# EAGLE design STM32 (EAGLE 8.6.3)
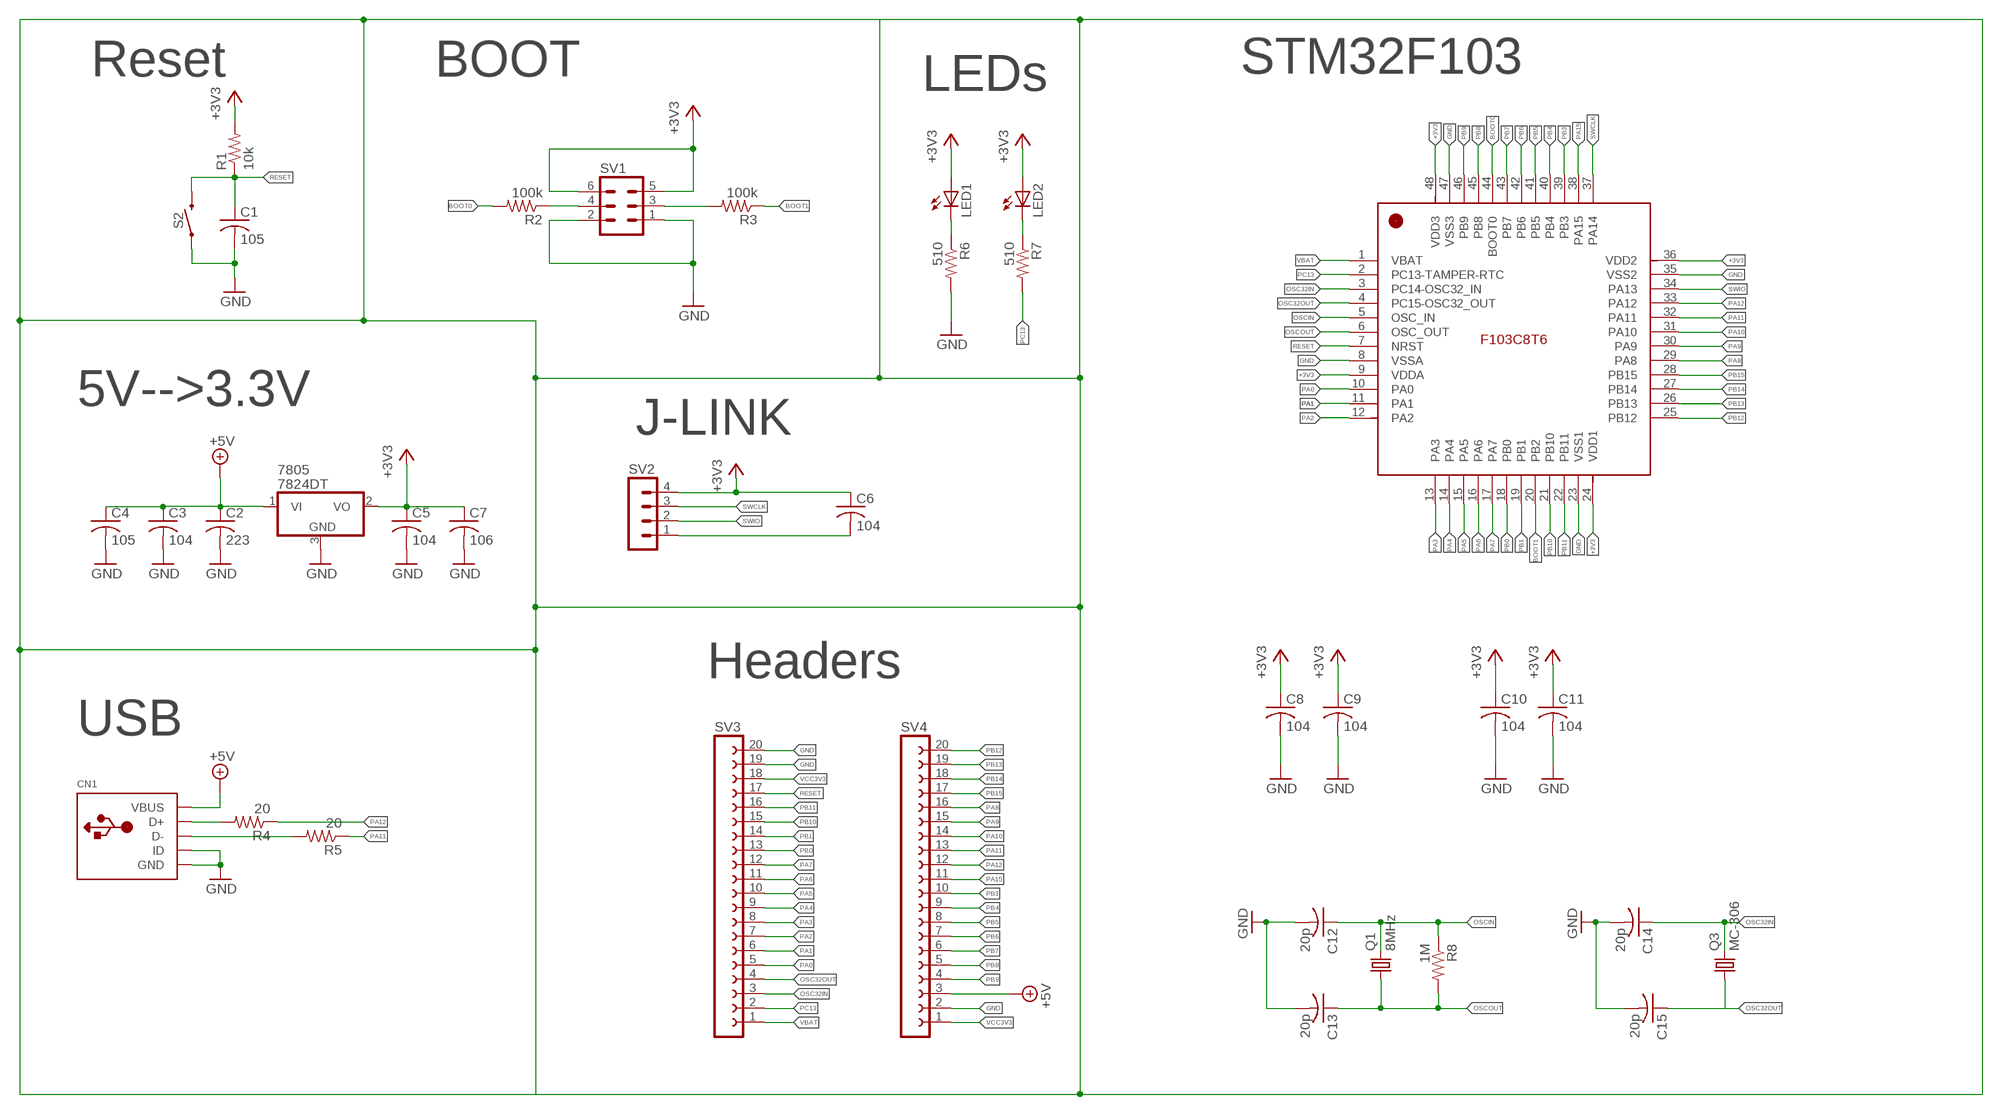
[diagram p0: schematic, sheet 1]

## Parts
7805  7824DT  [TO252]
C1  105  C-USC0603  [C0603]
C2  223  C-USC0603  [C0603]
C3  104  C-USC0603  [C0603]
C4  105  C-USC0805  [C0805]
C5  104  C-USC0603  [C0603]
C6  104  C-USC0603  [C0603]
C7  106  C-USC0805  [C0805]
C8  104  C-USC0603  [C0603]
C9  104  C-USC0603  [C0603]
C10  104  C-USC0603  [C0603]
C11  104  C-USC0603  [C0603]
C12  20p  C-USC0603  [C0603]
C13  20p  C-USC0603  [C0603]
C14  20p  C-USC0603  [C0603]
C15  20p  C-USC0603  [C0603]
CN1  USBMINIB  [USB-MINIB]
LED1  LEDCHIPLED_0805  [CHIPLED_0805]
LED2  LEDCHIPLED_0805  [CHIPLED_0805]
Q1  8MHz  CRYTALHC49U70  [HC49U70]
Q3  MC-306  [MC-306]
R1  10k  R-US_R0603  [R0603]
R2  100k  R-US_R0603  [R0603]
R3  100k  R-US_R0603  [R0603]
R4  20  R-US_R0603  [R0603]
R5  20  R-US_R0603  [R0603]
R6  510  R-US_R0603  [R0603]
R7  510  R-US_R0603  [R0603]
R8  1M  R-US_R0603  [R0603]
S2  MOMENTARY-SWITCH-SPST-SMD-5.2-REDUNDANT  [TACTILE_SWITCH_SMD_5.2MM]
SV1  MA03-2  [MA03-2]
SV2  MA04-1  [MA04-1]
SV3  FE20-1  [FE20]
SV4  FE20-1  [FE20]
U$1  STM32F103C8T6  [LQFP48_7X7MM_0.5MMPP]

## Nets
+3V3: 7805.2(VO) C5.1 C6.1 C7.1 C8.1 C9.1 C10.1 C11.1 LED1.A LED2.A R1.2 SV1.5 SV1.6 SV2.4 U$1.9(VDDA) U$1.24(VDD1) U$1.36(VDD2) U$1.48(VDD3)
+5V: 7805.1(VI) C2.1 C3.1 C4.1 CN1.VBUS SV4.3
BOOT0: R2.2 U$1.44(BOOT0)
BOOT1: R3.1 U$1.20(PB2)
GND: 7805.3(GND) C1.2 C2.2 C3.2 C4.2 C5.2 C7.2 C8.2 C9.2 C10.2 C11.2 C12.2 C13.2 C14.2 C15.2 CN1.GND CN1.ID R6.2 S2.1 S2.2 SV1.1 SV1.2 SV3.19 SV3.20 SV4.2 U$1.8(VSSA) U$1.23(VSS1) U$1.35(VSS2) U$1.47(VSS3)
N$1: R2.1 SV1.4
N$2: R3.2 SV1.3
N$3: LED1.C R6.1
N$5: CN1.D+ R4.2
N$6: CN1.D- R5.2
N$7: LED2.C R7.1
N$8: C6.2 SV2.1
OSC32IN: C14.1 Q3.4 SV3.3 U$1.3(PC14-OSC32_IN)
OSC32OUT: C15.1 Q3.1 SV3.4 U$1.4(PC15-OSC32_OUT)
OSCIN: C12.1 Q1.2 R8.1 U$1.5(OSC_IN)
OSCOUT: C13.1 Q1.1 R8.2 U$1.6(OSC_OUT)
PA0: SV3.5 U$1.10(PA0)
PA1: SV3.6 U$1.11(PA1)
PA2: SV3.7 U$1.12(PA2)
PA3: SV3.8 U$1.13(PA3)
PA4: SV3.9 U$1.14(PA4)
PA5: SV3.10 U$1.15(PA5)
PA6: SV3.11 U$1.16(PA6)
PA7: SV3.12 U$1.17(PA7)
PA8: SV4.16 U$1.29(PA8)
PA9: SV4.15 U$1.30(PA9)
PA10: SV4.14 U$1.31(PA10)
PA11: R5.1 SV4.13 U$1.32(PA11)
PA12: R4.1 SV4.12 U$1.33(PA12)
PA15: SV4.11 U$1.38(PA15)
PB0: SV3.13 U$1.18(PB0)
PB1: SV3.14 U$1.19(PB1)
PB3: SV4.10 U$1.39(PB3)
PB4: SV4.9 U$1.40(PB4)
PB5: SV4.8 U$1.41(PB5)
PB6: SV4.7 U$1.42(PB6)
PB7: SV4.6 U$1.43(PB7)
PB8: SV4.5 U$1.45(PB8)
PB9: SV4.4 U$1.46(PB9)
PB10: SV3.15 U$1.21(PB10)
PB11: SV3.16 U$1.22(PB11)
PB12: SV4.20 U$1.25(PB12)
PB13: SV4.19 U$1.26(PB13)
PB14: SV4.18 U$1.27(PB14)
PB15: SV4.17 U$1.28(PB15)
PC13: R7.2 SV3.2 U$1.2(PC13-TAMPER-RTC)
RESET: C1.1 R1.1 S2.3 S2.4 SV3.17 U$1.7(NRST)
SWCLK: SV2.3 U$1.37(PA14)
SWIO: SV2.2 U$1.34(PA13)
VBAT: SV3.1 U$1.1(VBAT)
VCC3V3: SV3.18 SV4.1

## Notes on the sheet
- Reset | BOOT | STM32F103
- LEDs
- 5V-->3.3V
- J-LINK
- Headers
- USB

## Library data of the parts
7805 = linear3:78*: Positive VOLTAGE REGULATOR Source: http://cache.national.com/ds/LM/LM78L05.pdf http://www.fairchildsemi.com/ds/LM/LM7805.pdf
C1-C15 = rcl:C-US: CAPACITOR, American symbol; SPICEPREFIX: C
CN1 = adafruit:USB: USB Connectors USBMINIB - Surface Mount Female Mini-B USB Connector 4UConnector: 06564 By microbuilder.eu Thru-hole RA Female Mini-B USB Connector 4UConnector: 18732 By ladyada.net
LED1 LED2 = adafruit:LED: LED OSRAM: - CHIPLED LG R971, LG N971, LY N971, LG Q971, LY Q971, LO R971, LY R971 LH N974, LH R974 LS Q976, LO Q976, LY Q976 LO Q996 - Hyper CHIPLED LW Q18S LB Q993, LB Q99A, LB R99A - SideLED LS A670, LO A670, LY A670, LG A670, LP A670 LB A673, LV A673, LT A673, LW A673 LH A674 LY A675 LS A676, LA A676, LO A676, LY A676, LW A676 LS A679, LY A679, LG A679 - Hyper Micro SIDELED® LS Y876, LA Y876, LO Y876, LY Y876 LT Y87S - SmartLED LW L88C, LW L88S LB L89C, LB L89S, LG L890 LS L89K, LO L89K, LY L89K LS L896, LA L896, LO L896, LY L896 - TOPLED LS T670, LO T670, LY T670, LG T670, LP T670 LSG T670, LSP T670, LSY T670, LOP T670, LYG T670 LG T671, LOG T671, LSG T671 LB T673, LV T673, LT T673, LW T673 LH T674 LS T676, LA T676, LO T676, LY T676, LB T676, LH T676, LSB T676, LW T676 LB T67C, LV T67C, LT T67C, LS T67K, LO T67K, LY T67K, LW E67C LS E67B, LA E67B, LO E67B, LY E67B, LB E67C, LV E67C, LT E67C LW T67C LS T679, LY T679, LG T679 LS T770, LO T770, LY T770, LG T770, LP T770 LB T773, LV T773, LT T773, LW T773 LH T774 LS E675, LA E675, LY E675, LS T675 LS T776, LA T776, LO T776, LY T776, LB T776 LHGB T686 LT T68C, LB T68C - Hyper Mini TOPLED® LB M676 - Mini TOPLED Santana® LG M470 LS M47K, LO M47K, LY M47K Source: http://www.osram.convergy.de/
Q1 = crystal:CRYTAL: CRYSTAL
Q3 = crystal:MC-306: kHz RANGE CRYSTAL UNIT SMD Source: MC-306_405_406_E07X.PDF Homepage <http://www.epsontoyocom.co.jp>; MPN: MC-306 60.0KHZ 100PPM ,12.5PF; OC_FARNELL: 1278040; OC_NEWARK: 31M5576
R1-R8 = rcl:R-US_: RESISTOR, American symbol; SPICEPREFIX: R
S2 = SparkFun-Switches:MOMENTARY-SWITCH-SPST: Momentary Switch (Pushbutton) - SPST Normally-open (NO) SPST momentary switches (buttons, pushbuttons). Variants PTH-12MM - 12mm square, through-hole Momentary Pushbutton Switch - 12mm Square <https://www.sparkfun.com/products/9190> (COM-09190) PTH-6.0MM, PTH-6.0MM-KIT - 6.0mm square, through-hole Mini Pushbutton Switch <https://www.sparkfun.com/products/97> (COM-00097) KIT package intended for soldering kit's - only one side of pads' copper is exposed. PTH-RIGHT-ANGLE-KIT - Right-angle, through-hole Right Angle Tactile Button <https://www.sparkfun.com/products/10791> - Used on SparkFun BigTime Watch Kit <https://www.sparkfun.com/products/11734> SMD-12MM - 12mm square, surface-mount Tactile Button - SMD (12mm) <https://www.sparkfun.com/products/12993> (COM-12993) Used on SparkFun PicoBoard <https://www.sparkfun.com/products/11888> SMD-4.5MM - 4.5mm Square Trackball Switch Used on SparkFun Blackberry Trackballer Breakout <https://www.sparkfun.com/products/13169> SMD-4.6MMX2.8MM - 4.60mm x 2.80mm, surface mount Used on SparkFun SAMD21 Mini Breakout <https://www.sparkfun.com/products/13664> SMD-5.2MM, SMD-5.2-REDUNDANT - 5.2mm square, surface-mount Mini Pushbutton Switch - SMD <https://www.sparkfun.com/products/8720> (COM-08720) Used on Arduino Pro Mini <https://www.sparkfun.com/products/11114> REDUNDANT package connects both switch circuits together SMD-6.0X3.5MM - 6.0 x 3.5mm, surface mount Momentary Reset Switch SMD <https://www.sparkfun.com/products/8229> (COM-08229) SMD-6.2MM-TALL - 6.2mm square, surface mount Tactile Button - SMD (6mm) <https://www.sparkfun.com/products/12992> Used on SparkFun Digital Sandbox <https://www.sparkfun.com/products/12651> SMD-RIGHT-ANGLE - Right-angle, surface mount Used on SparkFun Block for Intel® Edison - Arduino <https://www.sparkfun.com/products/13036>; PROD_ID: SWCH-08247; SF_SKU: COM-08720
SV1 = con-lstb:MA03-2: PIN HEADER; OC_FARNELL: unknown; OC_NEWARK: unknown
SV2 = con-lstb:MA04-1: PIN HEADER; OC_FARNELL: unknown; OC_NEWARK: unknown
SV3 SV4 = con-lsta:FE20-1: FEMALE HEADER; OC_FARNELL: unknown; OC_NEWARK: unknown
U$1 = STM32F103C8T6:STM32F103C8T6; AVAILABILITY: Unavailable; DESCRIPTION: Mainstream Performance line, ARM Cortex-M3 MCU with 64 Kbytes Flash, 72 MHz CPU, motor control, USB and CAN; MF: STMicroelectronics; MP: STM32F103C8T6; PACKAGE: LQFP-48 STMicroelectronics; PRICE: None

## Board
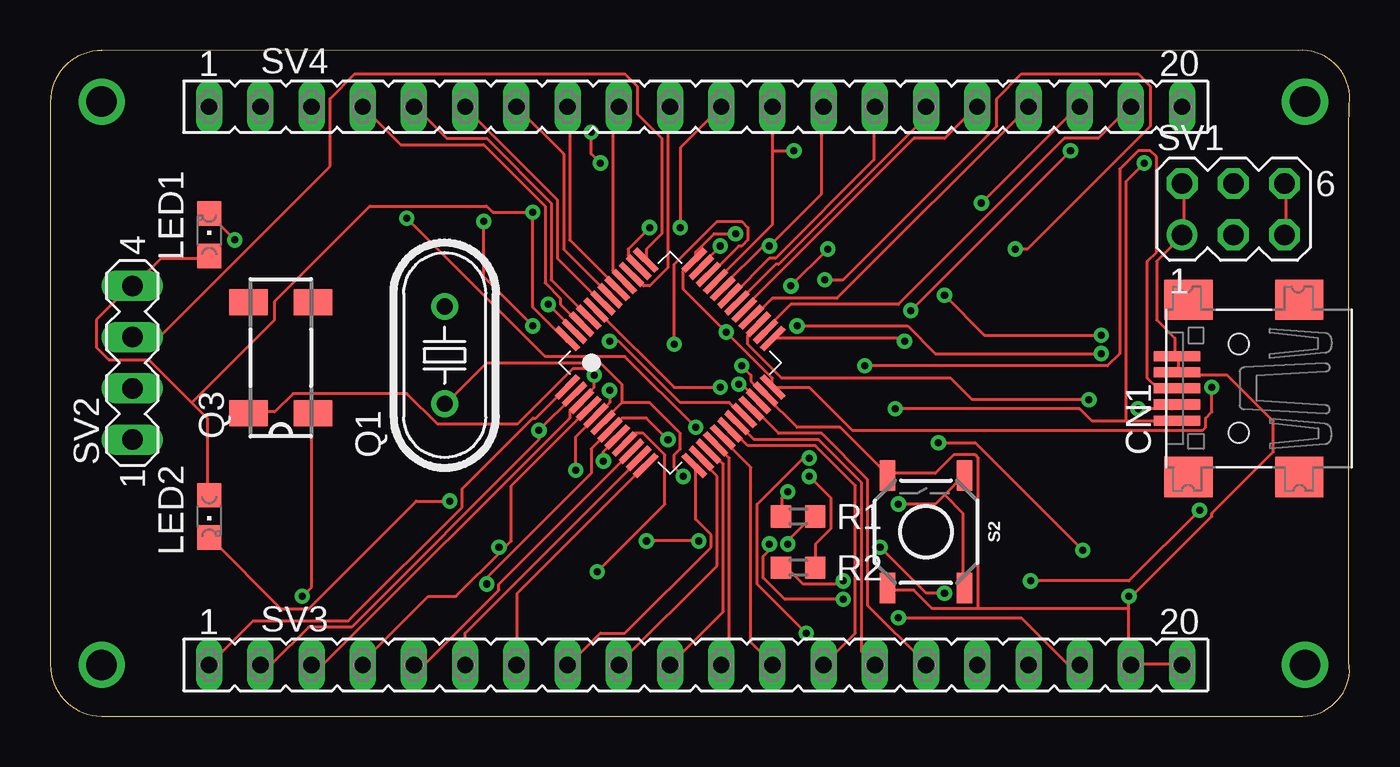
[diagram p1: board, top side]
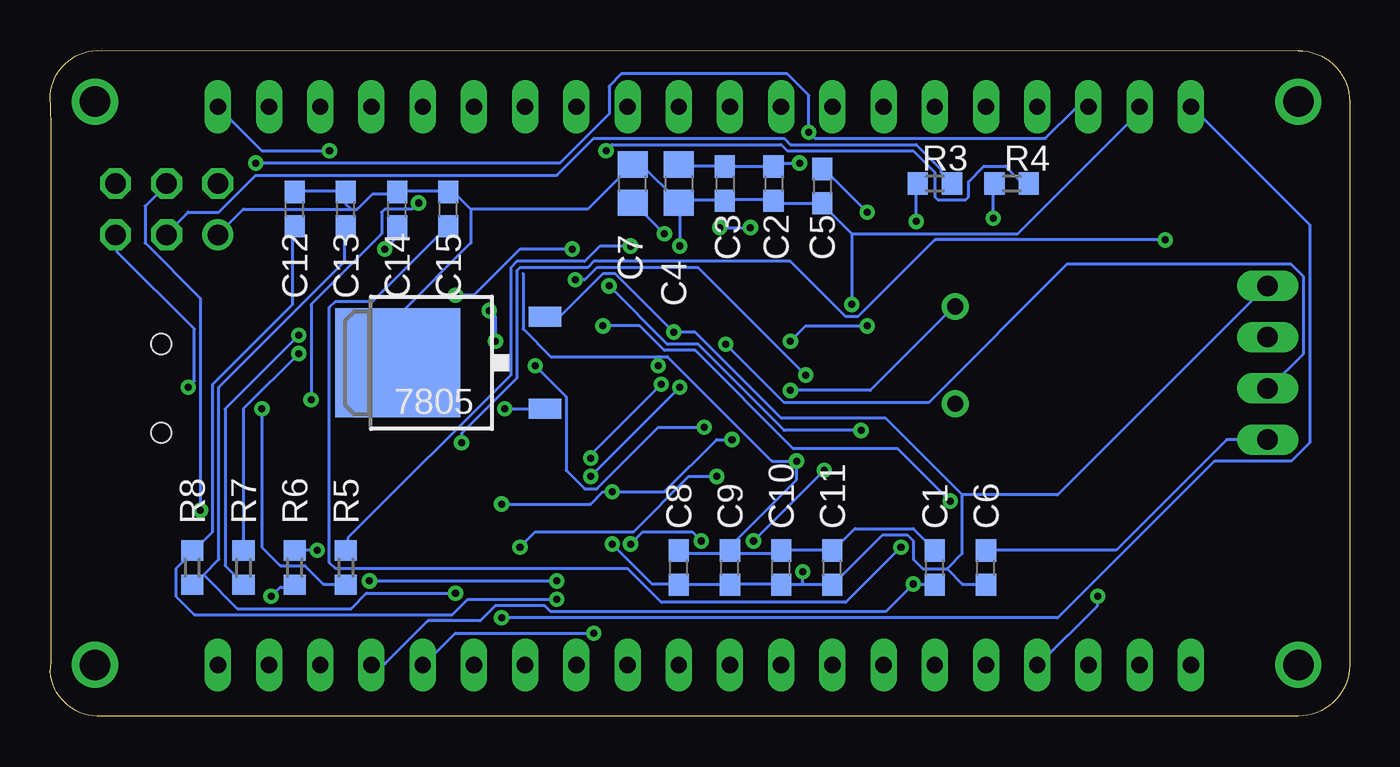
[diagram p2: board, bottom side, seen from below]

Size 64.44 x 33.03 mm. Coordinates in mm from the lower left corner, seen from the top.
Outline: 2.54,0.01 61.9,0.01 arc90 64.44,2.22 64.39,2.67 64.39,29.34 64.44,30.82 arc90 61.9,33.02 2.54,33.03 2.55,33.02 arc90 0,30.48 0,2.55 arc90 2.54,0.01
Copper layers (1*16): Top 0.035mm / dielectric 1.5mm / Bottom 0.035mm
Design rules "default": minimum track width 6mil, minimum drill 0.35mm, track to track 6mil, track to pad 6mil, pad to pad 6mil, via to via 6mil, smd to smd 6mil, copper to edge 40mil, drill to drill 6mil, minimum pad ring 10mil, minimum via ring 8mil, stop-mask expansion 4mil, vias tented up to drill 0mil, thermal gap 10mil

### Footprints (pad centres in the part's own frame; a part is rotated, then mirrored left to right if it is on the bottom)
TO252 = smd 1 x 1.6: 1 -2.28,-4.8; 2 2.28,-4.8 | smd 5.4 x 6.2: 3 0,2.5
C0603 = smd 1.1 x 1: 1 -0.85,0; 2 0.85,0
C0805 = smd 1.3 x 1.5: 1 -0.95,0; 2 0.95,0
USB-MINIB = smd 0.5 x 2.308: D+ 0,4.064; D- -0.8,4.064; GND 1.6,4.064; ID 0.8,4.064; VBUS -1.6,4.064 | smd 2 x 2.4: GND1 -4.4,-2; GND2 -4.4,3.5; GND3 4.4,3.5; GND4 4.4,-2 | hole 1: -2.2,1; 2.2,1
CHIPLED_0805 = smd 1.2 x 1.2: A 0,-1.05; C 0,1.05
HC49U70 = drill 0.813: 1 -2.413,0; 2 2.413,0
MC-306 = smd 1.3 x 1.9: 1 -2.75,-1.6; 2 2.75,-1.6; 3 2.75,1.6; 4 -2.75,1.6
R0603 = smd 1 x 1.1: 1 -0.85,0; 2 0.85,0
TACTILE_SWITCH_SMD_5.2MM = smd 1.524 x 0.762: 1 -2.794,1.905; 2 2.794,1.905; 3 -2.794,-1.905; 4 2.794,-1.905
MA03-2 = drill 1.016: 1 -2.54,-1.27 | drill 1.016 octagon: 2 -2.54,1.27; 3 0,-1.27; 4 0,1.27; 5 2.54,-1.27; 6 2.54,1.27
MA04-1 = drill 1.016 long: 1 -3.81,0; 2 -1.27,0; 3 1.27,0; 4 3.81,0
FE20 = drill 0.813 long: 1 -24.13,0; 2 -21.59,0; 3 -19.05,0; 4 -16.51,0; 5 -13.97,0; 6 -11.43,0; 7 -8.89,0; 8 -6.35,0; 9 -3.81,0; 10 -1.27,0; 11 1.27,0; 12 3.81,0; 13 6.35,0; 14 8.89,0; 15 11.43,0; 16 13.97,0; 17 16.51,0; 18 19.05,0; 19 21.59,0; 20 24.13,0
LQFP48_7X7MM_0.5MMPP = smd 1.5 x 0.3: 1 -4.45,2.75; 2 -4.45,2.25; 3 -4.45,1.75; 4 -4.45,1.25; 5 -4.45,0.75; 6 -4.45,0.25; 7 -4.45,-0.25; 8 -4.45,-0.75; 9 -4.45,-1.25; 10 -4.45,-1.75; 11 -4.45,-2.25; 12 -4.45,-2.75; 25 4.45,-2.75; 26 4.45,-2.25; 27 4.45,-1.75; 28 4.45,-1.25; 29 4.45,-0.75; 30 4.45,-0.25; 31 4.45,0.25; 32 4.45,0.75; 33 4.45,1.25; 34 4.45,1.75; 35 4.45,2.25; 36 4.45,2.75 | smd 0.3 x 1.5: 13 -2.75,-4.45; 14 -2.25,-4.45; 15 -1.75,-4.45; 16 -1.25,-4.45; 17 -0.75,-4.45; 18 -0.25,-4.45; 19 0.25,-4.45; 20 0.75,-4.45; 21 1.25,-4.45; 22 1.75,-4.45; 23 2.25,-4.45; 24 2.75,-4.45; 37 2.75,4.45; 38 2.25,4.45; 39 1.75,4.45; 40 1.25,4.45; 41 0.75,4.45; 42 0.25,4.45; 43 -0.25,4.45; 44 -0.75,4.45; 45 -1.25,4.45; 46 -1.75,4.45; 47 -2.25,4.45; 48 -2.75,4.45

### Placement (x,y rotation side)
7805  44.7,17.53 90 bottom
C1  20.57,7.37 90 bottom
C2  28.57,26.42 270 bottom
C3  30.99,26.42 270 bottom
C4  33.27,26.42 270 bottom
C5  26.16,26.29 270 bottom
C6  18.03,7.37 90 bottom
C7  35.56,26.42 90 bottom
C8  33.27,7.37 90 bottom
C9  30.73,7.37 90 bottom
C10  28.19,7.37 90 bottom
C11  25.65,7.37 90 bottom
C12  52.32,25.15 90 bottom
C13  49.78,25.15 90 bottom
C14  47.24,25.15 90 bottom
C15  44.7,25.15 90 bottom
CN1  59.94,16.26 90 top
LED1  7.87,23.88 0 top
LED2  7.87,9.91 180 top
Q1  19.56,17.91 90 top
Q3  11.43,17.79 90 top
R1  37.08,9.91 0 top
R2  37.08,7.37 0 top
R3  20.57,26.42 0 bottom
R4  16.76,26.42 180 bottom
R5  49.78,7.37 270 bottom
R6  52.32,7.37 270 bottom
R7  54.86,7.37 270 bottom
R8  57.4,7.37 270 bottom
S2  43.43,9.15 90 top
SV1  58.67,25.15 0 top
SV2  4.06,17.53 90 top
SV3  32,2.55 0 top
SV4  32,30.23 0 top
U$1  30.73,17.53 45 top

### Tracks (layer width: path | path; a pad name or v marks a point on that pad's centre or on a via)
+3V3  (via drill 0.35)
  Top 0.152: SV1.5 61.27,23.93 61.27,26.37 SV1.6 | v57.61,16.31 57.61,15.09 57.3,14.79 57.3,14.33 57.15,14.18 39.78,14.18 37.64,16.31 35.97,16.31 U$1.24 35.81,16.46 35.81,16.77 v33.53,19.06 31.39,21.19 31.39,22.1 31.85,22.56 U$1.36 32,22.71 32,23.02 32.92,23.93 v33.98,23.93 | v36.58,8.54 36.58,8.69 37.8,9.91 R1.2 | v27.13,7.17 30.48,10.52 30.48,12.96 29.41,14.03 28.96,14.03 28.5,13.57 U$1.9 | U$1.48 25.6,18.6 23.93,20.27 v23.93,25 21.95,25 21.64,25.3 15.85,25.3 11.12,20.58 11.12,19.67 7.01,15.55 | 7.01,15.55 4.88,17.68 2.9,17.68 2.29,18.29 2.29,19.67 3.96,21.34 SV2.4 4.12,21.34 5.49,22.71 7.77,22.71 LED1.A | 7.01,15.55 7.77,14.79 7.77,10.98 LED2.A
  Bottom 0.152: v57.61,16.31 57.3,16.62 57.3,19.21 61.11,23.02 61.11,23.78 SV1.5 | v36.58,8.54 34.59,6.56 33.38,6.56 C8.1 33.22,6.56 30.79,6.56 C9.1 30.63,6.56 28.19,6.56 | 28.19,6.56 27.13,6.56 | 27.13,6.56 25.76,6.56 C11.1 25.6,6.56 23.16,9 21.95,9 21.64,8.69 21.64,7.78 21.18,7.32 19.96,7.32 | 27.13,6.56 v27.13,7.17 | 28.19,6.56 C10.1 | v33.98,23.93 35.51,25.46 C7.1 | 7805.2 39.78,19.82 39.17,19.82 37.03,21.95 36.42,21.95 v33.53,19.06 32.46,19.06 28.19,14.79 23.01,14.79 19.2,10.98 | 19.96,7.32 19.2,6.56 18.14,6.56 C6.1 | 19.2,10.98 19.2,8.08 19.96,7.32 | v23.93,25 26.06,27.13 C5.1 | 19.2,10.98 14.48,10.98 4.12,21.34 SV2.4
+5V  (via drill 0.35)
  Top 0.152: v41.91,15.25 51.05,15.25 51.66,14.64 53.34,14.64 | 53.34,14.64 55.78,14.64 CN1.VBUS | v26.82,28.96 26.82,27.89 v27.28,27.44 | 53.34,14.64 53.34,26.52 v54.25,27.44
  Bottom 0.152: C4.1 33.22,27.29 31.09,27.29 C3.1 30.94,27.29 28.65,27.29 C2.1 28.5,27.29 28.35,27.44 v27.28,27.44 | v41.91,15.25 39.93,15.25 7805.1 | SV4.3 12.95,30.18 13.56,30.18 15.09,28.66 26.52,28.66 v26.82,28.96 26.82,30.79 27.89,31.86 36.12,31.86 36.73,31.25 36.73,29.88 39.17,27.44 v54.25,27.44
BOOT0  (via drill 0.35)
  Top 0.152: v37.64,11.89 38.71,10.83 38.71,9.3 37.95,8.54 37.95,7.47 R2.2 | v33.22,16.31 30.94,16.31 27.13,20.12 U$1.44
  Bottom 0.152: v33.22,16.31 v37.64,11.89
BOOT1  (via drill 0.35)
  Top 0.152: v21.49,24.54 21.49,21.8 v23.93,19.36 | v27.74,18.6 28.19,18.6 31.24,15.55 33.68,15.55 34.29,14.94 U$1.20
  Bottom 0.152: v21.49,24.54 21.49,26.37 R3.1 | v23.93,19.36 26.98,19.36 v27.74,18.6
GND  (via drill 0.35)
  Top 0.152: SV1.2 56.24,26.37 56.24,23.93 SV1.1 56.08,23.78 54.86,22.56 54.86,19.67 55.78,18.75 55.78,17.99 CN1.GND 55.93,17.84 55.93,17.07 CN1.ID 55.93,16.92 58.37,16.92 60.66,14.64 60.66,13.11 57.61,10.06 57.61,9.91 53.49,5.8 | 53.49,5.34 53.49,2.6 SV3.19 53.65,2.6 56.08,2.6 SV3.20 | 53.49,5.34 53.49,5.8 | 53.49,5.34 46.02,5.34 | 46.02,5.34 43.74,5.34 42.82,6.25 41.6,6.25 S2.1 | 46.02,5.34 46.02,12.81 45.87,12.96 44.81,12.96 43.89,12.05 41.6,12.05 S2.2 41.45,12.05 39.17,14.33 37.03,14.33 35.51,15.86 U$1.23 35.36,16.01 34.75,16.62 34.75,16.92 v34.29,17.38 | 53.49,5.8 v53.49,5.95 | v27.43,12.65 27.43,13.11 28.04,13.72 U$1.8 | v33.22,23.32 32.31,22.41 U$1.35 | v24.69,20.43 25.91,19.21 U$1.47
  Bottom 0.152: 49.53,25.15 54.86,25.15 SV1.1 | 49.53,25.15 49.23,25.15 48.46,25.91 47.24,25.91 C14.2 47.24,26.07 44.81,26.07 C15.2 44.65,25.91 44.35,25.91 43.59,25.15 | 43.59,25.15 43.59,23.48 47.09,19.97 47.09,17.53 7805.3 | v53.49,5.95 53.03,6.41 52.43,6.41 R6.2 | C9.2 30.79,8.08 33.22,8.08 C8.2 | C9.2 30.63,8.24 30.63,8.54 27.43,11.74 v27.43,12.65 28.65,12.65 33.83,17.84 34.29,17.84 | C9.2 30.63,8.08 28.19,8.08 C10.2 25.76,8.24 C11.2 25.6,8.24 24.54,9.3 21.64,9.3 C1.2 | C4.2 33.22,25.61 31.09,25.61 C3.2 30.94,25.61 28.65,25.61 C2.2 28.5,25.46 26.21,25.46 C5.2 26.06,25.3 24.69,23.93 | v33.22,23.32 33.22,25.46 C4.2 | C4.2 33.38,25.61 35.05,27.29 35.51,27.29 C7.2 35.66,27.29 37.8,25.15 43.59,25.15 | 24.69,23.93 v24.69,20.43 | 24.69,23.93 16.46,23.93 10.52,29.88 10.52,30.18 SV4.2 | 34.29,17.84 39.62,17.84 41,19.21 41,21.95 | 34.29,17.84 v34.29,17.38 | 49.53,25.15 49.78,25.41 C13.2 49.84,26.07 52.27,26.07 C12.2
N$1  (via drill 0.35)
  Top 0.152: v39.32,6.71 39.17,6.56 37.34,6.56 36.58,7.32 36.27,7.32 R2.1 | v48.62,6.71 53.49,6.71 v57,10.22
  Bottom 0.152: v48.62,6.71 v39.32,6.71 | v57,10.22 57,20.73 59.74,23.48 59.74,25.3 58.67,26.37 SV1.4
N$2
  Bottom 0.152: R3.2 19.81,26.52 20.27,26.98 20.27,27.13 21.49,28.35 27.74,28.35 28.04,28.66 37.49,28.66 39.32,26.83 54.25,26.83 56.08,25 57.61,25 58.67,23.93 SV1.3
N$3  (via drill 0.35)
  Top 0.152: v51.21,8.24 45.87,13.57 v44.04,13.57 | v9.14,23.63 7.92,24.85 LED1.C
  Bottom 0.152: v51.21,8.24 52.27,8.24 R6.1 | v44.04,13.57 44.04,14.03 41.3,16.77 41.3,22.1 41.15,22.26 37.8,22.26 37.49,22.56 27.74,22.56 24.99,19.82 24.38,19.82 20.57,23.63 v9.14,23.63
N$5  (via drill 0.35)
  Top 0.152: v17.68,24.69 24.54,17.84 28.5,17.84 v32,14.33 | v40.39,17.38 52.43,17.38 53.03,17.99 53.03,27.13 53.95,28.05 54.56,28.05 54.86,27.74 54.86,23.02 54.41,22.56 54.41,16.77 54.86,16.31 55.78,16.31 CN1.D+
  Bottom 0.152: v17.68,24.69 17.68,26.37 R4.2 | v32,14.33 34.29,14.33 37.34,11.28 37.95,11.28 38.86,12.2 38.86,15.86 v40.39,17.38
N$6  (via drill 0.35)
  Top 0.152: v53.95,15.25 55.63,15.25 55.78,15.4 CN1.D-
  Bottom 0.152: v53.95,15.25 53.95,8.39 53.03,7.47 51.82,7.47 50.9,6.56 49.84,6.56 R5.2
N$7  (via drill 0.35)
  Top 0.152: v52.12,17.99 43.89,17.99 42.52,19.36 v37.03,19.36 | v19.81,10.67 18.14,10.67 12.8,5.34 11.43,5.34 7.92,8.84 LED2.C
  Bottom 0.152: R7.1 54.86,15.25 v52.12,17.99 | v37.03,19.36 35.2,19.36 33.98,18.14 32.46,18.14 27.58,13.26 22.4,13.26 v19.81,10.67
N$8
  Bottom 0.152: SV2.1 6.1,13.72 11.58,8.24 17.98,8.24 C6.2
N$10  (via drill 1.52)
  other vias: 2.54,2.55
N$11  (via drill 1.52)
  other vias: 62.23,2.55
N$12  (via drill 1.52)
  other vias: 62.23,30.49
N$13  (via drill 1.52)
  other vias: 2.54,30.49
OSC32IN  (via drill 0.35)
  Top 0.152: v47.85,23.17 48.46,23.17 54.56,29.27 54.56,31.25 53.95,31.86 48.16,31.86 46.94,30.64 46.94,29.27 39.32,21.65 v38.41,21.65 | Q3.4 9.91,15.09 11.12,15.09 12.04,16.01 17.68,16.01 19.2,14.48 23.16,14.48 25.91,17.23 26.67,17.23 v26.98,16.92 26.98,16.31 26.36,15.7 U$1.3 26.21,15.55 25.76,15.09 25.76,14.79 13.56,2.6 12.95,2.6 SV3.3
  Bottom 0.152: C14.1 47.24,23.78 v47.85,23.17 | v38.41,21.65 37.95,21.65 37.34,22.26 32.31,22.26 v26.98,16.92
OSC32OUT  (via drill 0.35)
  Top 0.152: 22.4,8.24 20.12,5.95 18.75,5.95 15.39,2.6 SV3.4 | 22.4,8.24 22.86,8.69 22.86,11.44 26.67,15.25 U$1.4 | 22.4,8.24 v22.25,8.39 | v12.5,5.95 12.95,6.41 12.95,14.94 Q3.1
  Bottom 0.152: v22.25,8.39 24.99,5.64 34.14,5.64 35.81,7.32 50.29,7.32 50.6,7.63 50.6,20.27 50.29,20.58 48.46,20.58 44.81,24.24 C15.1 | v12.5,5.95 12.5,5.49 15.39,2.6 SV3.4
OSCIN  (via drill 0.35)
  Top 0.152: v27.74,16.16 27.74,15.55 27.13,14.94 U$1.5 26.98,14.79 26.06,13.87 v26.06,12.2 | v32.16,8.69 v29.57,8.69 | v35.66,8.54 35.66,8.24 35.36,7.93 35.36,6.86 36.42,5.8 v39.32,5.8
  Bottom 0.152: v27.74,16.16 23.77,16.16 19.66,20.27 Q1.2 | C12.1 52.43,24.24 52.43,20.43 56.39,16.46 56.39,9.15 57.3,8.24 R8.1 57.45,8.08 58.22,7.32 58.22,5.95 57.3,5.03 44.5,5.03 43.74,5.8 v39.32,5.8 | v29.57,8.69 v26.06,12.2 | v32.16,8.69 32.61,9.15 35.05,9.15 v35.66,8.54
OSCOUT  (via drill 0.35)
  Top 0.152: 28.35,15.55 27.43,14.64 U$1.6 | 28.35,15.55 28.35,16.46 27.28,17.53 21.64,17.53 19.66,15.55 Q1.1 | 28.35,15.55 29.72,15.55 31.24,14.03 31.24,13.26 30.94,12.96 30.94,12.35 v31.39,11.89 | v41.15,8.39 43.43,6.1 v44.35,6.1
  Bottom 0.152: 56.84,7.02 57.3,6.56 R8.2 | 56.84,7.02 56.08,7.78 56.08,16.31 49.84,22.56 49.84,24.24 C13.1 | v31.39,11.89 32.77,11.89 35.51,9.15 40.39,9.15 v41.15,8.39 | v44.35,6.1 48.77,6.1 49.53,5.34 55.17,5.34 56.84,7.02
PA0
  Top 0.152: U$1.10 28.8,13.11 22.25,6.56 22.25,6.25 18.59,2.6 18.14,2.6 SV3.5
PA1
  Top 0.152: SV3.6 20.57,4.12 29.11,12.65 U$1.11
PA2
  Top 0.152: U$1.12 29.41,12.35 23.16,6.1 23.16,2.6 SV3.7
PA3
  Top 0.152: U$1.13 32,12.35 32,9.76 32.77,9 32.77,8.39 28.5,4.12 27.28,4.12 25.76,2.6 SV3.8
PA4
  Top 0.152: U$1.14 32.31,12.65 33.07,11.89 33.07,7.47 28.19,2.6 SV3.9
PA5
  Top 0.152: SV3.10 33.38,5.19 33.38,12.5 32.77,13.11 U$1.15
PA6
  Top 0.152: U$1.16 33.07,13.42 33.68,12.81 33.68,2.9 33.38,2.6 SV3.11
PA7
  Top 0.152: U$1.17 33.38,13.72 34.75,12.35 34.75,3.66 35.81,2.6 SV3.12
PA8
  Top 0.152: U$1.29 34.44,20.27 42.82,28.66 44.35,28.66 45.87,30.18 SV4.16
PA9
  Top 0.152: SV4.15 43.43,29.72 36.12,22.41 35.97,22.41 34.14,20.58 U$1.30
PA10
  Top 0.152: U$1.31 33.83,20.88 35.66,22.71 35.97,22.71 40.84,27.59 40.84,30.18 SV4.14
PA11  (via drill 0.35)
  Top 0.152: U$1.32 33.38,21.34 35.36,23.32 v35.66,23.32 38.25,25.91 38.25,30.18 SV4.13
  Bottom 0.152: v35.66,23.32 37.19,23.32 37.95,22.56 41.3,22.56 41.6,22.26 41.6,16.92 49.68,8.84 49.68,8.24 R5.1
PA12  (via drill 0.35)
  Top 0.152: SV4.12 35.81,28.05 | 35.81,28.05 35.81,24.39 33.07,21.65 U$1.33 | 35.81,28.05 v36.88,28.05
  Bottom 0.152: v36.88,28.05 36.58,28.35 28.19,28.35 27.89,28.05 21.64,28.05 20.57,26.98 20.57,25.76 20.42,25.61 19.05,25.61 18.9,25.76 18.9,26.52 18.14,27.29 17.07,27.29 16.31,26.52 16,26.52 R4.1
PA15  (via drill 0.35)
  Top 0.152: v29.72,24.24 28.65,23.17 28.65,22.87 29.11,22.41 U$1.38 | v31.24,24.24 31.24,28.2 SV4.11
  Bottom 0.152: v31.24,24.24 v29.72,24.24
PB0
  Top 0.152: SV3.13 39.93,4.12 39.93,11.44 37.95,13.42 34.59,13.42 33.83,14.18 U$1.18
PB1
  Top 0.152: SV3.14 40.23,3.21 40.23,11.59 38.1,13.72 34.9,13.72 34.14,14.48 U$1.19
PB3
  Top 0.152: U$1.39 28.96,21.8 29.41,21.34 29.72,21.34 30.63,22.26 30.63,30.18 SV4.10
PB4
  Top 0.152: U$1.40 28.35,21.65 27.89,22.1 27.89,29.88 28.19,30.18 SV4.9
PB5
  Top 0.152: U$1.41 28.04,21.34 25.76,23.63 25.76,30.18 SV4.8
PB6
  Top 0.152: SV4.7 25.45,27.89 25.45,23.17 27.74,20.88 U$1.42
PB7
  Top 0.152: U$1.43 27.28,20.58 25.15,22.71 25.15,25.61 20.57,30.18 SV4.6
PB8
  Top 0.152: U$1.45 26.67,19.82 24.84,21.65 24.84,25.46 21.64,28.66 19.66,28.66 18.14,30.18 SV4.5
PB9
  Top 0.152: SV4.4 17.37,28.35 21.49,28.35 24.54,25.3 24.54,21.49 25.3,20.73 25.3,20.43 26.21,19.51 U$1.46
PB10
  Top 0.152: U$1.21 34.9,15.25 36.12,14.03 38.25,14.03 40.54,11.74 40.54,5.49 43.43,2.6 SV3.15
PB11  (via drill 0.35)
  Top 0.152: v34.14,16.46 34.29,16.46 35.05,15.7 U$1.22 | v37.64,12.81 37.34,12.81 35.05,10.52 35.05,6.56 v37.49,4.12
  Bottom 0.152: v34.14,16.46 37.64,12.96 v37.64,12.81 | v37.49,4.12 44.35,4.12 45.87,2.6 SV3.16
PB12  (via drill 0.35)
  Top 0.152: v42.37,18.6 42.22,18.75 35.97,18.75 U$1.25 | v50.6,28.05 v42.67,20.12
  Bottom 0.152: v42.37,18.6 42.37,19.82 v42.67,20.12 | v50.6,28.05 53.95,28.05 SV4.20
PB13
  Top 0.152: U$1.26 35.51,19.21 36.73,20.43 42.06,20.43 50.29,28.66 51.97,28.66 53.49,30.18 SV4.19
PB14  (via drill 0.35)
  Top 0.152: v51.51,15.7 45.72,15.7 44.65,16.77 36.27,16.77 34.59,18.45 34.59,18.9 35.05,19.36 U$1.27 | v46.18,25.46 51.05,30.33 SV4.18
  Bottom 0.152: v51.51,15.7 51.51,20.43 48.01,23.93 48.01,25 47.85,25.15 46.48,25.15 v46.18,25.46
PB15
  Top 0.152: SV4.17 39.01,20.73 35.81,20.73 34.9,19.82 U$1.28
PC13  (via drill 0.35)
  Top 0.152: v52.12,18.9 46.33,18.9 v44.35,20.88 | v36.73,21.34 v38.56,23.17 | U$1.2 25.91,15.86 v24.23,14.18 24.23,13.72 14.94,4.43 12.8,4.43 10.97,2.6 10.52,2.6 SV3.2
  Bottom 0.152: v52.12,18.9 55.78,15.25 55.78,7.47 54.86,6.56 R7.2 | v44.35,20.88 43.43,20.88 41.15,23.17 v38.56,23.17 | v36.73,21.34 33.83,18.45 32.31,18.45 28.04,14.18 v24.23,14.18
RESET  (via drill 0.35)
  Top 0.152: v21.64,6.56 21.64,6.86 26.82,12.05 26.82,13.26 27.74,14.18 U$1.7 27.89,14.33 28.35,14.79 29.57,14.79 v30.63,13.72 | v36.58,11.13 36.27,10.83 36.27,9.91 R1.1 | v42.06,10.52 43.89,10.52 44.35,10.98 | 44.35,10.98 45.26,11.89 S2.4 | 44.35,10.98 45.26,10.06 45.26,6.41 S2.3
  Bottom 0.152: C1.1 20.57,6.56 v21.64,6.56 23.01,5.19 39.62,5.19 39.93,5.49 42.37,5.49 43.13,4.73 45.72,4.73 47.85,2.6 48.46,2.6 SV3.17 | v42.06,10.52 37.64,10.52 37.03,11.13 v36.58,11.13 33.98,11.13 31.39,13.72 v30.63,13.72
SWCLK
  Top 0.152: U$1.37 29.57,22.71 29.57,23.17 30.33,23.93 30.33,28.66 29.11,29.88 29.11,31.25 28.5,31.86 15.09,31.86 13.87,30.64 13.87,27.29 5.49,18.9 4.12,18.9 SV2.3
SWIO  (via drill 0.35)
  Top 0.152: v30.94,18.45 30.94,22.41 33.07,24.54 34.29,24.54 34.59,24.24 34.59,23.63 34.29,23.32 34.14,23.32 32.77,21.95 U$1.34
  Bottom 0.152: v30.94,18.45 28.04,15.55 20.88,15.55 14.02,22.41 2.9,22.41 2.29,21.8 2.29,17.99 3.96,16.31 SV2.2
VBAT
  Top 0.152: SV3.1 10.06,4.73 14.78,4.73 20.42,10.37 20.42,11.28 23.93,14.79 24.08,14.79 25.6,16.31 U$1.1
VCC3V3  (via drill 0.35)
  Top 0.152: v42.06,4.88 48.16,4.88 50.44,2.6 51.05,2.6 SV3.18
  Bottom 0.152: v42.06,4.88 14.48,4.88 6.71,12.65 2.9,12.65 1.98,13.57 1.98,24.39 7.77,30.18 SV4.1